# Altium schematic sheet Sheet1.SchDoc
size A3
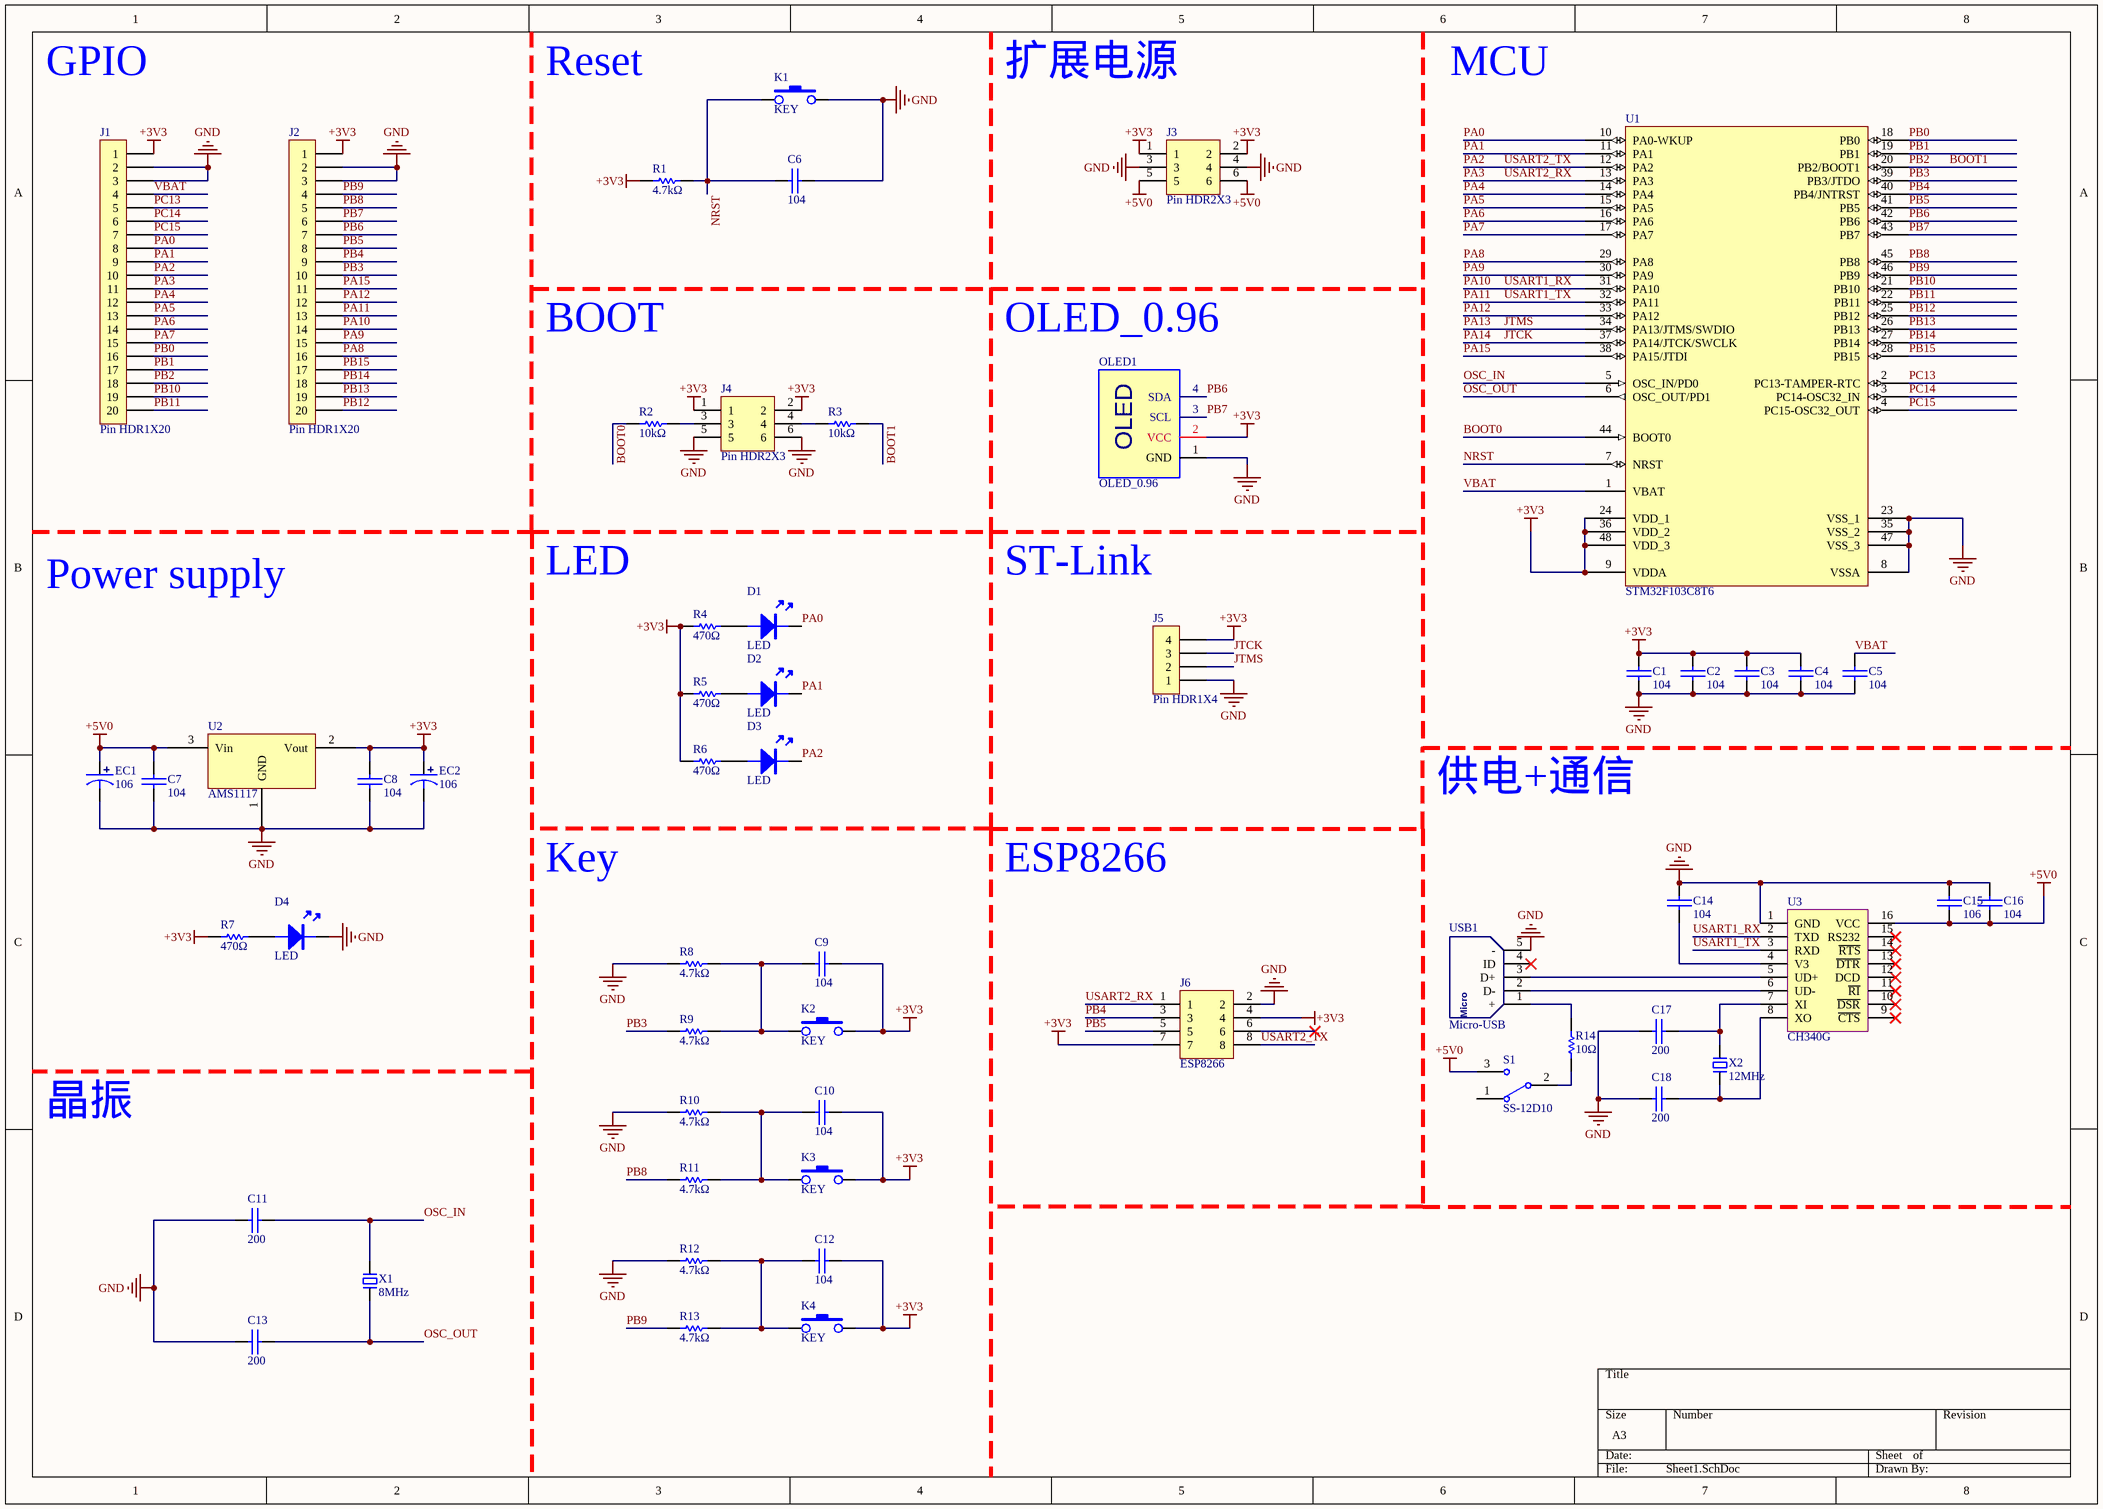
[diagram p0: Sheet1.SchDoc]

## Parts
C1  104  [0805C]
C2  104  [0805C]
C3  104  [0805C]
C4  104  [0805C]
C5  104  [0805C]
C6  104  [0805C]
C7  104  [0805C]
C8  104  [0805C]
C9  104  [0805C]
C10  104  [0805C]
C11  200  [0805C]
C12  104  [0805C]
C13  200  [0805C]
C14  104  [0805C]
C15  106  [0805C]
C16  104  [0805C]
C17  200  [0805C]
C18  200  [0805C]
D1  LED  [LED-0805R]
D2  LED  [LED-0805G]
D3  LED  [LED-0805B]
D4  LED  [LED-0805B]
EC1  106  [SMD-EC4.0X4.3X5.4]
EC2  106  [SMD-EC4.0X4.3X5.4]
J1  Pin HDR1X20  [Pin HDR1X20/2.54mm-S]
J2  Pin HDR1X20  [Pin HDR1X20/2.54mm-S]
J3  Pin HDR2X3  [Pin HDR2X3/2.54mm-S]
J4  Pin HDR2X3  [Pin HDR2X3/2.54mm-S]
J5  Pin HDR1X4  [Pin HDR1X4/2.54mm-S]
J6  ESP8266  [Fe-HDR2X4/2.54-S]
K1  KEY  [SMD-6X6X5]
K2  KEY  [SMD-6X6X5]
K3  KEY  [SMD-6X6X5]
K4  KEY  [SMD-6X6X5]
OLED1  OLED_0.96  [OLED_0.96]
R1  4.7kΩ  [0805R]
R2  10kΩ  [0805R]
R3  10kΩ  [0805R]
R4  470Ω  [0805R]
R5  470Ω  [0805R]
R6  470Ω  [0805R]
R7  470Ω  [0805R]
R8  4.7kΩ  [0805R]
R9  4.7kΩ  [0805R]
R10  4.7kΩ  [0805R]
R11  4.7kΩ  [0805R]
R12  4.7kΩ  [0805R]
R13  4.7kΩ  [0805R]
R14  10Ω  [2512R]
S1  SS-12D10  [SS-12D10]
U1  STM32F103C8T6  [LQFP48 7X7]
U2  AMS1117  [SOT223]
U3  CH340G  [SOP16]
USB1  Micro-USB  [USB-MICRO_A]
X1  8MHz  [OSC HC-49SMD]
X2  12MHz  [OSC HC-49SMD]

## Nets
+3V3: C1.2 C2.2 C3.2 C4.2 C8.2 C9.2 C10.2 C12.2 EC2.1 J1.1 J2.1 J3.1 J3.2 J4.1 J4.2 J5.4 J6.4 J6.7 K2.3 K3.3 K4.3 OLED1.2(VCC) R1.1 R4.1 R5.1 R6.1 R7.1 U1.9(VDDA) U1.24(VDD_1) U1.36(VDD_2) U1.48(VDD_3) U2.2(Vout)
+5V0: C7.1 C15.1 C16.1 EC1.1 J3.5 J3.6 S1.3 U2.3(Vin) U3.16(VCC)
GND: C1.1 C2.1 C3.1 C4.1 C5.1 C6.2 C7.2 C8.1 C11.1 C13.1 C14.2 C15.2 C16.2 C17.1 C18.1 D4.K EC1.2 EC2.2 J1.2 J1.3 J2.2 J2.3 J3.3 J3.4 J4.5 J4.6 J5.1 J6.2 K1.3 OLED1.1(GND) R8.1 R10.1 R12.1 U1.8(VSSA) U1.23(VSS_1) U1.35(VSS_2) U1.47(VSS_3) U2.1(GND) U3.1(GND) USB1.5(-)
BOOT0: R2.1 U1.44(BOOT0)
BOOT1: J1.18 R3.2 U1.20(PB2/BOOT1)  [also labelled PB2]
JTCK: J5.3 U1.37(PA14/JTCK/SWCLK)  [also labelled PA14]
JTMS: J5.2 U1.34(PA13/JTMS/SWDIO)  [also labelled PA13]
NRST: C6.1 K1.1 R1.2 U1.7(NRST)
OSC_IN: C11.2 U1.5(OSC_IN/PD0) X1.2
OSC_OUT: C13.2 U1.6(OSC_OUT/PD1) X1.1
PA0: D1.K J1.8 U1.10(PA0-WKUP)
PA1: D2.K J1.9 U1.11(PA1)
PA2: D3.K J1.10 J6.8 U1.12(PA2)  [also labelled USART2_TX]
PA3: J1.11 J6.1 U1.13(PA3)  [also labelled USART2_RX]
PA4: J1.12 U1.14(PA4)
PA5: J1.13 U1.15(PA5)
PA6: J1.14 U1.16(PA6)
PA7: J1.15 U1.17(PA7)
PA8: J2.16 U1.29(PA8)
PA9: J2.15 U1.30(PA9)
PA10: J2.14 U1.31(PA10) U3.2(TXD)  [also labelled USART1_RX]
PA11: J2.13 U1.32(PA11) U3.3(RXD)  [also labelled USART1_TX]
PA12: J2.12 U1.33(PA12)
PA15: J2.11 U1.38(PA15/JTDI)
PB0: J1.16 U1.18(PB0)
PB1: J1.17 U1.19(PB1)
PB3: J2.10 R9.1 U1.39(PB3/JTDO)
PB4: J2.9 J6.3 U1.40(PB4/JNTRST)
PB5: J2.8 J6.5 U1.41(PB5)
PB6: J2.7 OLED1.4(SDA) U1.42(PB6)
PB7: J2.6 OLED1.3(SCL) U1.43(PB7)
PB8: J2.5 R11.1 U1.45(PB8)
PB9: J2.4 R13.1 U1.46(PB9)
PB10: J1.19 U1.21(PB10)
PB11: J1.20 U1.22(PB11)
PB12: J2.20 U1.25(PB12)
PB13: J2.19 U1.26(PB13)
PB14: J2.18 U1.27(PB14)
PB15: J2.17 U1.28(PB15)
PC13: J1.5 U1.2(PC13-TAMPER-RTC)
PC14: J1.6 U1.3(PC14-OSC32_IN)
PC15: J1.7 U1.4(PC15-OSC32_OUT)
VBAT: C5.2 J1.4 U1.1(VBAT)
NetC9_1: C9.1 K2.1 R8.2 R9.2
NetC10_1: C10.1 K3.1 R10.2 R11.2
NetC12_1: C12.1 K4.1 R12.2 R13.2
NetC14_1: C14.1 U3.4(V3)
NetC17_2: C17.2 U3.7(XI) X2.2
NetC18_2: C18.2 U3.8(XO) X2.1
NetD1_A: D1.A R4.2
NetD2_A: D2.A R5.2
NetD3_A: D3.A R6.2
NetD4_A: D4.A R7.2
NetJ4_3: J4.3 R2.2
NetJ4_4: J4.4 R3.1
NetR14_1: R14.1 S1.2
NetR14_2: R14.2 USB1.1(+)
NetU3_5: U3.5(UD+) USB1.3(D+)
NetU3_6: U3.6(UD-) USB1.2(D-)

Not connected (* = marked no-connect by the designer): J6 6*; S1 1; U3 9(~{CTS})* 10(~{DSR})* 11(~{RI})* 12(DCD)* 13(~{DTR})* 14(~{RTS})* 15(RS232)*; USB1 4(ID)*

## Notes on the sheet
- GPIO
- Reset
- 扩展电源
- MCU
- BOOT
- OLED_0.96
- LED
- ST-Link
- Power supply
- 供电+通信
- Key
- ESP8266
- 晶振
- (in symbol Micro-USB) Micro
- (in symbol OLED_0.96) OLED

## Library data of the parts
C1-C18 = CAP: 无极性电容
EC1 EC2 = SMD_ECAP: 贴片电解电容
J6 = Female HDR2X4
R1-R14 = RES
U2 = AMS1117: 三端稳压芯片
X1 X2 = XTAL-2P: 2脚无源脚晶振